# Altium project snes.PrjPcb
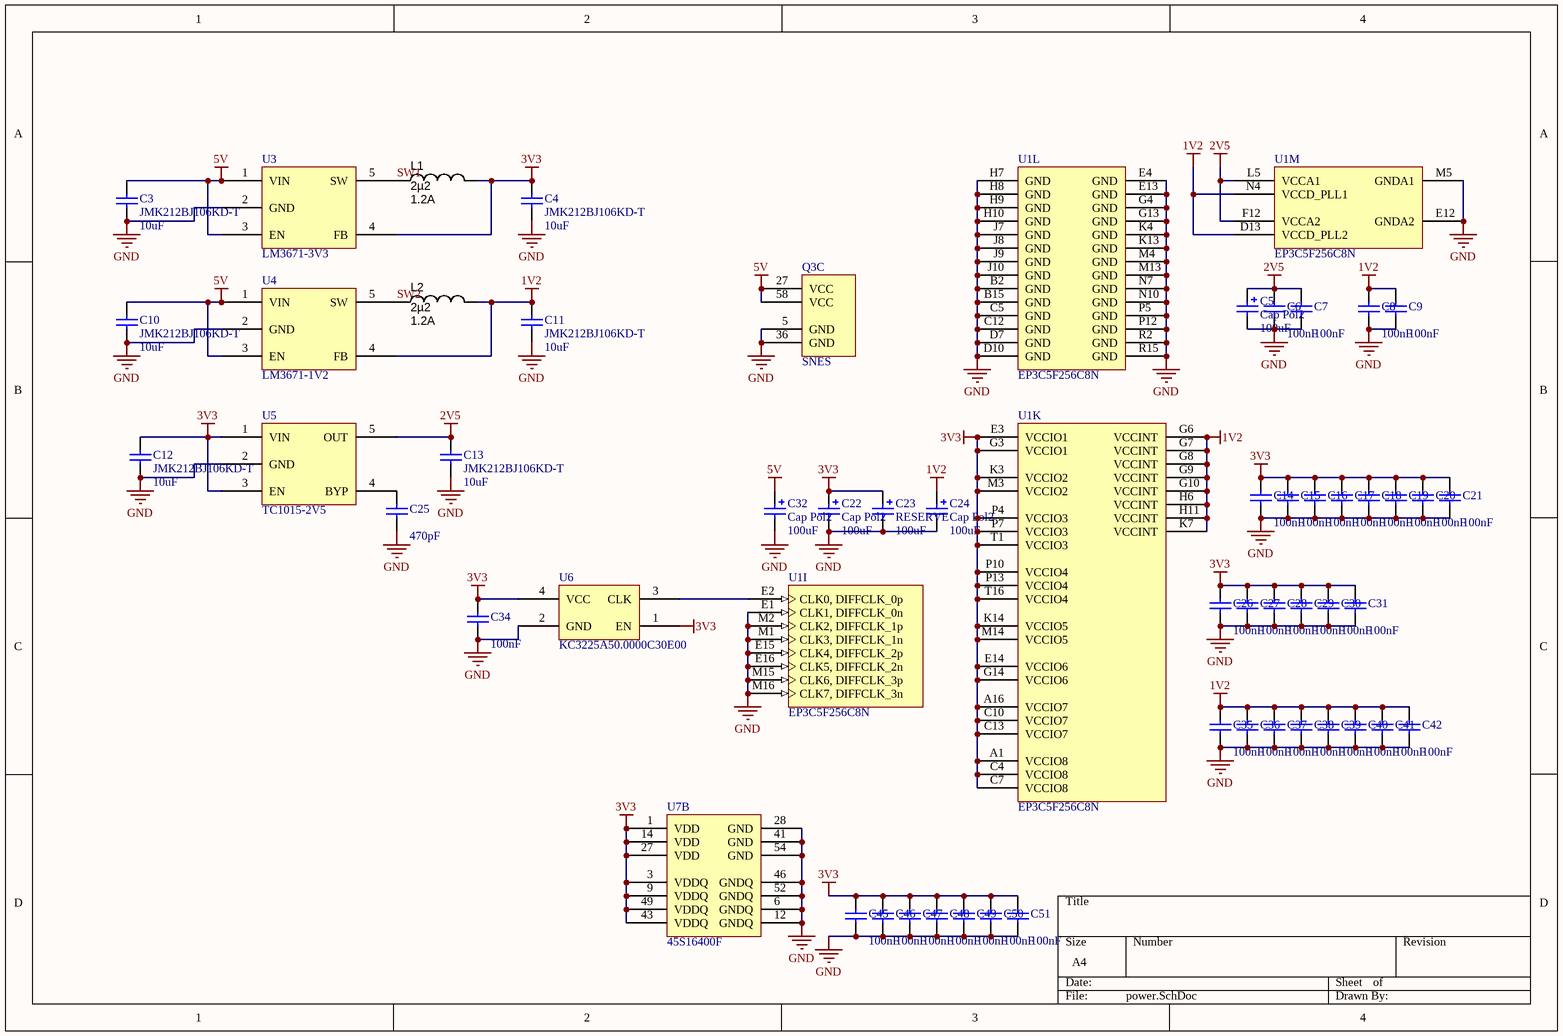
[diagram p0: power.SchDoc]
4 sheets, 87 parts. Net scope: global (net labels, ports and power ports of the same name join across sheets).
Board file: pcb.PcbDoc
Sheets:
  power.SchDoc
  snesio.SchDoc
  mem.SchDoc
  conf.SchDoc

## Sheet power.SchDoc
size A4

### Parts
C3  JMK212BJ106KD-T  value 10uF  [CAPC2012X135N]
C4  JMK212BJ106KD-T  value 10uF  [CAPC2012X135N]
C5  Cap Pol2  value 100uF  [CAPC3225X220N]
C6  value 100nF  [CAPC1005X06L]
C7  value 100nF  [CAPC1005X06L]
C8  value 100nF  [CAPC1005X06L]
C9  value 100nF  [CAPC1005X06L]
C10  JMK212BJ106KD-T  value 10uF  [CAPC2012X135N]
C11  JMK212BJ106KD-T  value 10uF  [CAPC2012X135N]
C12  JMK212BJ106KD-T  value 10uF  [CAPC2012X135N]
C13  JMK212BJ106KD-T  value 10uF  [CAPC2012X135N]
C14  value 100nF  [CAPC1005X06L]
C15  value 100nF  [CAPC1005X06L]
C16  value 100nF  [CAPC1005X06L]
C17  value 100nF  [CAPC1005X06L]
C18  value 100nF  [CAPC1005X06L]
C19  value 100nF  [CAPC1005X06L]
C20  value 100nF  [CAPC1005X06L]
C21  value 100nF  [CAPC1005X06L]
C22  Cap Pol2  value 100uF  [CAPC3225X220N]
C23  RESERVE  value 100uF  [CAPC3225X220N]
C24  Cap Pol2  value 100uF  [CAPC3225X220N]
C25  value 470pF  [CAPC2012X135N]
C26  value 100nF  [CAPC1005X06L]
C27  value 100nF  [CAPC1005X06L]
C28  value 100nF  [CAPC1005X06L]
C29  value 100nF  [CAPC1005X06L]
C30  value 100nF  [CAPC1005X06L]
C31  value 100nF  [CAPC1005X06L]
C32  Cap Pol2  value 100uF  [CAPC3225X220N]
C34  value 100nF  [CAPC1005X06L]
C35  value 100nF  [CAPC1005X06L]
C36  value 100nF  [CAPC1005X06L]
C37  value 100nF  [CAPC1005X06L]
C38  value 100nF  [CAPC1005X06L]
C39  value 100nF  [CAPC1005X06L]
C40  value 100nF  [CAPC1005X06L]
C41  value 100nF  [CAPC1005X06L]
C42  value 100nF  [CAPC1005X06L]
C45  value 100nF  [CAPC1005X06L]
C46  value 100nF  [CAPC1005X06L]
C47  value 100nF  [CAPC1005X06L]
C48  value 100nF  [CAPC1005X06L]
C49  value 100nF  [CAPC1005X06L]
C50  value 100nF  [CAPC1005X06L]
C51  value 100nF  [CAPC1005X06L]
L1  1.2A  value 2µ2  [INDM3225X240N]
L2  1.2A  value 2µ2  [INDM3225X240N]
Q3  SNES  [SNES]  (part C of 3)
U1  EP3C5F256C8N  [FBGA256-2]  (parts I,K,L,M of 13)
U3  LM3671-3V3  [SOT23-5]
U4  LM3671-1V2  [SOT23-5]
U5  TC1015-2V5  [SOT23-5]
U6  KC3225A50.0000C30E00  [KC3225A]
U7  45S16400F  [TSOP2-54_N]  (part B of 2)

### Nets
1V2: C8.2 C9.2 C11.2 C24.1 C35.2 C36.2 C37.2 C38.2 C39.2 C40.2 C41.2 C42.2 L2.2 U1.D13(VCCD_PLL2) U1.G6(VCCINT) U1.G7(VCCINT) U1.G8(VCCINT) U1.G9(VCCINT) U1.G10(VCCINT) U1.H6(VCCINT) U1.H11(VCCINT) U1.K7(VCCINT) U1.N4(VCCD_PLL1) U4.4(FB)
2V5: C5.1 C6.2 C7.2 C13.2 U1.F12(VCCA2) U1.L5(VCCA1) U5.5(OUT)
3V3: C4.2 C12.2 C14.2 C15.2 C16.2 C17.2 C18.2 C19.2 C20.2 C21.2 C22.1 C23.1 C26.2 C27.2 C28.2 C29.2 C30.2 C31.2 C34.2 C45.2 C46.2 C47.2 C48.2 C49.2 C50.2 C51.2 L1.2 U1.A1(VCCIO8) U1.A16(VCCIO7) U1.C4(VCCIO8) U1.C7(VCCIO8) U1.C10(VCCIO7) U1.C13(VCCIO7) U1.E3(VCCIO1) U1.E14(VCCIO6) U1.G3(VCCIO1) U1.G14(VCCIO6) U1.K3(VCCIO2) U1.K14(VCCIO5) U1.M3(VCCIO2) U1.M14(VCCIO5) U1.P4(VCCIO3) U1.P7(VCCIO3) U1.P10(VCCIO4) U1.P13(VCCIO4) U1.T1(VCCIO3) U1.T16(VCCIO4) U3.4(FB) U5.1(VIN) U5.3(EN) U6.1(EN) U6.4(VCC) U7.1(VDD) U7.3(VDDQ) U7.9(VDDQ) U7.14(VDD) U7.27(VDD) U7.43(VDDQ) U7.49(VDDQ)
5V: C3.2 C10.2 C32.1 Q3.27(VCC) Q3.58(VCC) U3.1(VIN) U3.3(EN) U4.1(VIN) U4.3(EN)
GND: C3.1 C4.1 C5.2 C6.1 C7.1 C8.1 C9.1 C10.1 C11.1 C12.1 C13.1 C14.1 C15.1 C16.1 C17.1 C18.1 C19.1 C20.1 C21.1 C22.2 C23.2 C24.2 C25.1 C26.1 C27.1 C28.1 C29.1 C30.1 C31.1 C32.2 C34.1 C35.1 C36.1 C37.1 C38.1 C39.1 C40.1 C41.1 C42.1 C45.1 C46.1 C47.1 C48.1 C49.1 C50.1 C51.1 Q3.5(GND) Q3.36(GND) U1.B2(GND) U1.B15(GND) U1.C5(GND) U1.C12(GND) U1.D7(GND) U1.D10(GND) U1.E1(CLK1,_DIFFCLK_0n) U1.E4(GND) U1.E12(GNDA2) U1.E13(GND) U1.E15(CLK4,_DIFFCLK_2p) U1.E16(CLK5,_DIFFCLK_2n) U1.G4(GND) U1.G13(GND) U1.H7(GND) U1.H8(GND) U1.H9(GND) U1.H10(GND) U1.J7(GND) U1.J8(GND) U1.J9(GND) U1.J10(GND) U1.K4(GND) U1.K13(GND) U1.M1(CLK3,_DIFFCLK_1n) U1.M2(CLK2,_DIFFCLK_1p) U1.M4(GND) U1.M5(GNDA1) U1.M13(GND) U1.M15(CLK6,_DIFFCLK_3p) U1.M16(CLK7,_DIFFCLK_3n) U1.N7(GND) U1.N10(GND) U1.P5(GND) U1.P12(GND) U1.R2(GND) U1.R15(GND) U3.2(GND) U4.2(GND) U5.2(GND) U6.2(GND) U7.6(GNDQ) U7.12(GNDQ) U7.28(GND) U7.41(GND) U7.46(GNDQ) U7.52(GNDQ) U7.54(GND)
SW1: L1.1 U3.5(SW)
SW2: L2.1 U4.5(SW)
NetC25_2: C25.2 U5.4(BYP)
NetU1_E2: U1.E2(CLK0,_DIFFCLK_0p) U6.3(CLK)

### Library data of the parts
C3 C4 C6-C21 C25-C31 C34-C42 C45-C51 = Cap: Capacitor; Published: 8-Jun-2000; LatestRevisionDate: 17-Jul-2002; LatestRevisionNote: Re-released for DXP Platform.; PackageReference: RAD-0.3; Publisher: Altium Limited; PackageDescription: Radial Cap, Thru-Hole; 2 Leads; 0.3 in Pin Spacing
C5 C22-C24 C32 = Cap Pol2: Polarized Capacitor (Axial); Published: 8-Jun-2000; LatestRevisionDate: 17-Jul-2002; LatestRevisionNote: Re-released for DXP Platform.; PackageReference: POLAR0.8; Publisher: Altium Limited; PackageDescription: Polarized Capacitor; 2 Leads
L1 L2 = INDC_2u2_1210_1200mA: Inductor 2.2uH 1.2A 1210 SMD chip; Manufacturer 1: TDK Corporation; Manufacturer Part Number 1: NLCV32T-2R2M-PFR; Ratings: 1.2 Adc; Tolerance: ±20%; Type: Ferrite Core; DC Resistance (DCR): 115 mOhm; Q @ Freq: 15 @ 7.96MHz; Frequency - Self Resonant: 68MHz; Frequency - Test: 7.96MHz; SCDType: source; Package / Case: 1210 (3225 Metric); Supplier 1: Digi-Key; Supplier Part Number 1: 445-3650-1-ND; ComponentLink1URL: http://www.tdk.co.jp/tefe02/e511_nlcv_nlc.pdf; ComponentLink1Description: http://www.tdk.co.jp/tefe02/e511_nlcv_nlc.pdf; Operating Temperature: -40°C ~ 125°C
U1 = EP3C5F256C8N: Cyclone III Family FPGA, 182 I/O Pins, 4 PLLs, 256-Pin FBGA, Speed Grade 8, Commercial Grade, Pb-Free; Published: 14-Mar-2008; DatasheetVersion: ver2.0, May-2008; PackageVersion: ver16.0, Dec-2009; PackageReference: FBGA256-2; Publisher: Altium Limited; PackageDescription: 256-Ball FineLine Ball Grid Array (FBGA256) - Option 2 - Wire Bond; Supplier 1: Digi-Key; Supplier Part Number 1: 544-2423-ND; Supplier 2: Farnell; Supplier Part Number 2: 1549367; Supplier 3: Farnell; Supplier Part Number 3: 1662274; Code_JEDEC: MO-192-DAF-1; ComponentLink1Description: Manufacturer Link; ComponentLink1URL: http://www.altera.com/; ComponentLink2Description: Handbook (7.86MB); ComponentLink2URL: http://www.altera.com/literature/hb/cyc3/cyclone3_handbook.pdf; ComponentLink3Description: Packaging Specification; ComponentLink3URL: http://www.altera.com/literature/ds/dspkg.pdf
U3 U4 = LM3671
U5 = TC1015
U6 = osc

## Sheet snesio.SchDoc
size A4
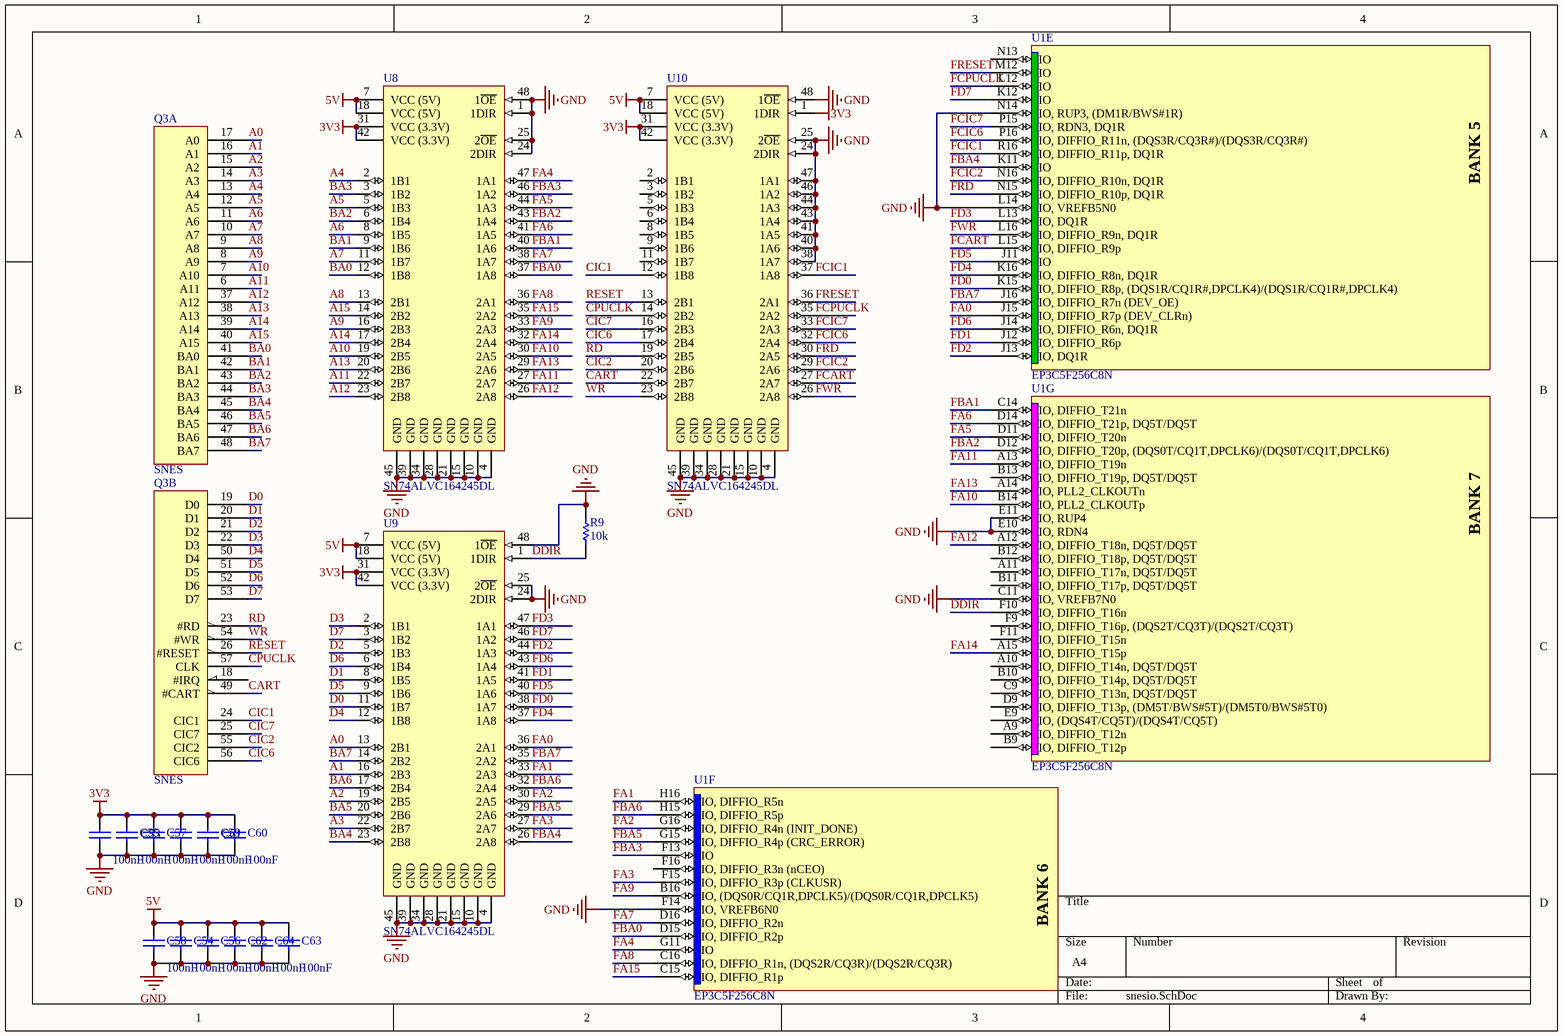
[diagram p1: snesio.SchDoc]

### Parts
C53  value 100nF  [CAPC1005X06L]
C54  value 100nF  [CAPC1005X06L]
C55  value 100nF  [CAPC1005X06L]
C56  value 100nF  [CAPC1005X06L]
C57  value 100nF  [CAPC1005X06L]
C58  value 100nF  [CAPC1005X06L]
C59  value 100nF  [CAPC1005X06L]
C60  value 100nF  [CAPC1005X06L]
C61  value 100nF  [CAPC1005X06L]
C62  value 100nF  [CAPC1005X06L]
C63  value 100nF  [CAPC1005X06L]
C64  value 100nF  [CAPC1005X06L]
Q3  SNES  [SNES]  (parts A,B of 3)
R9  value 10k  [RESC2012X70N]  (hidden comment: Res1)
U1  EP3C5F256C8N  [FBGA256-2]  (parts E,F,G of 13)
U8  SN74ALVC164245DL  [DL048]
U9  SN74ALVC164245DL  [DL048]
U10  SN74ALVC164245DL  [DL048]

### Nets
3V3: C53.2 C55.2 C57.2 C59.2 C60.2 C61.2 U8.31(VCC_(3.3V)) U8.42(VCC_(3.3V)) U9.31(VCC_(3.3V)) U9.42(VCC_(3.3V)) U10.1(1DIR) U10.31(VCC_(3.3V)) U10.42(VCC_(3.3V))
5V: C54.2 C56.2 C58.2 C62.2 C63.2 C64.2 U8.7(VCC_(5V)) U8.18(VCC_(5V)) U9.7(VCC_(5V)) U9.18(VCC_(5V)) U10.7(VCC_(5V)) U10.18(VCC_(5V))
GND: C53.1 C54.1 C55.1 C56.1 C57.1 C58.1 C59.1 C60.1 C61.1 C62.1 C63.1 C64.1 R9.1 U1.C11(IO,_VREFB7N0) U1.E10(IO,_RDN4) U1.E11(IO,_RUP4) U1.F14(IO,_VREFB6N0) U1.L14(IO,_VREFB5N0) U1.N14(IO,_RUP3,_(DM1R/BWS#1R)) U8.1(1DIR) U8.4(GND) U8.10(GND) U8.15(GND) U8.21(GND) U8.24(2DIR) U8.25(2~{OE}) U8.28(GND) U8.34(GND) U8.39(GND) U8.45(GND) U8.48(1~{OE}) U9.4(GND) U9.10(GND) U9.15(GND) U9.21(GND) U9.24(2DIR) U9.25(2~{OE}) U9.28(GND) U9.34(GND) U9.39(GND) U9.45(GND) U9.48(1~{OE}) U10.4(GND) U10.10(GND) U10.15(GND) U10.21(GND) U10.24(2DIR) U10.25(2~{OE}) U10.28(GND) U10.34(GND) U10.38(1A7) U10.39(GND) U10.40(1A6) U10.41(1A5) U10.43(1A4) U10.44(1A3) U10.45(GND) U10.46(1A2) U10.47(1A1) U10.48(1~{OE})
A0: Q3.17(A0) U9.13(2B1)
A1: Q3.16(A1) U9.16(2B3)
A2: Q3.15(A2) U9.19(2B5)
A3: Q3.14(A3) U9.22(2B7)
A4: Q3.13(A4) U8.2(1B1)
A5: Q3.12(A5) U8.5(1B3)
A6: Q3.11(A6) U8.8(1B5)
A7: Q3.10(A7) U8.11(1B7)
A8: Q3.9(A8) U8.13(2B1)
A9: Q3.8(A9) U8.16(2B3)
A10: Q3.7(A10) U8.19(2B5)
A11: Q3.6(A11) U8.22(2B7)
A12: Q3.37(A12) U8.23(2B8)
A13: Q3.38(A13) U8.20(2B6)
A14: Q3.39(A14) U8.17(2B4)
A15: Q3.40(A15) U8.14(2B2)
BA0: Q3.41(BA0) U8.12(1B8)
BA1: Q3.42(BA1) U8.9(1B6)
BA2: Q3.43(BA2) U8.6(1B4)
BA3: Q3.44(BA3) U8.3(1B2)
BA4: Q3.45(BA4) U9.23(2B8)
BA5: Q3.46(BA5) U9.20(2B6)
BA6: Q3.47(BA6) U9.17(2B4)
BA7: Q3.48(BA7) U9.14(2B2)
CART: Q3.49(#CART) U10.22(2B7)
CIC1: Q3.24(CIC1) U10.12(1B8)
CIC2: Q3.55(CIC2) U10.20(2B6)
CIC6: Q3.56(CIC6) U10.17(2B4)
CIC7: Q3.25(CIC7) U10.16(2B3)
CPUCLK: Q3.57(CLK) U10.14(2B2)
D0: Q3.19(D0) U9.11(1B7)
D1: Q3.20(D1) U9.8(1B5)
D2: Q3.21(D2) U9.5(1B3)
D3: Q3.22(D3) U9.2(1B1)
D4: Q3.50(D4) U9.12(1B8)
D5: Q3.51(D5) U9.9(1B6)
D6: Q3.52(D6) U9.6(1B4)
D7: Q3.53(D7) U9.3(1B2)
DDIR: R9.2 U1.F10(IO,_DIFFIO_T16n) U9.1(1DIR)
FA0: U1.J15(IO,_DIFFIO_R7p_(DEV_CLRn)) U9.36(2A1)
FA1: U1.H16(IO,_DIFFIO_R5n) U9.33(2A3)
FA2: U1.G16(IO,_DIFFIO_R4n_(INIT_DONE)) U9.30(2A5)
FA3: U1.F15(IO,_DIFFIO_R3p_(CLKUSR)) U9.27(2A7)
FA4: U1.G11(IO) U8.47(1A1)
FA5: U1.D11(IO,_DIFFIO_T20n) U8.44(1A3)
FA6: U1.D14(IO,_DIFFIO_T21p,_DQ5T/DQ5T) U8.41(1A5)
FA7: U1.D16(IO,_DIFFIO_R2n) U8.38(1A7)
FA8: U1.C16(IO,_DIFFIO_R1n,_(DQS2R/CQ3R)/(DQS2R/CQ3R)) U8.36(2A1)
FA9: U1.B16(IO,_(DQS0R/CQ1R,DPCLK5)/(DQS0R/CQ1R,DPCLK5)) U8.33(2A3)
FA10: U1.B14(IO,_PLL2_CLKOUTp) U8.30(2A5)
FA11: U1.A13(IO,_DIFFIO_T19n) U8.27(2A7)
FA12: U1.A12(IO,_DIFFIO_T18n,_DQ5T/DQ5T) U8.26(2A8)
FA13: U1.A14(IO,_PLL2_CLKOUTn) U8.29(2A6)
FA14: U1.A15(IO,_DIFFIO_T15p) U8.32(2A4)
FA15: U1.C15(IO,_DIFFIO_R1p) U8.35(2A2)
FBA0: U1.D15(IO,_DIFFIO_R2p) U8.37(1A8)
FBA1: U1.C14(IO,_DIFFIO_T21n) U8.40(1A6)
FBA2: U1.D12(IO,_DIFFIO_T20p,_(DQS0T/CQ1T,DPCLK6)/(DQS0T/CQ1T,DPCLK6)) U8.43(1A4)
FBA3: U1.F13(IO) U8.46(1A2)
FBA4: U1.K11(IO) U9.26(2A8)
FBA5: U1.G15(IO,_DIFFIO_R4p_(CRC_ERROR)) U9.29(2A6)
FBA6: U1.H15(IO,_DIFFIO_R5p) U9.32(2A4)
FBA7: U1.J16(IO,_DIFFIO_R7n_(DEV_OE)) U9.35(2A2)
FCART: U1.L15(IO,_DIFFIO_R9p) U10.27(2A7)
FCIC1: U1.R16(IO,_DIFFIO_R11p,_DQ1R) U10.37(1A8)
FCIC2: U1.N16(IO,_DIFFIO_R10n,_DQ1R) U10.29(2A6)
FCIC6: U1.P16(IO,_DIFFIO_R11n,_(DQS3R/CQ3R#)/(DQS3R/CQ3R#)) U10.32(2A4)
FCIC7: U1.P15(IO,_RDN3,_DQ1R) U10.33(2A3)
FCPUCLK: U1.L12(IO) U10.35(2A2)
FD0: U1.K15(IO,_DIFFIO_R8p,_(DQS1R/CQ1R#,DPCLK4)/(DQS1R/CQ1R#,DPCLK4)) U9.38(1A7)
FD1: U1.J12(IO,_DIFFIO_R6p) U9.41(1A5)
FD2: U1.J13(IO,_DQ1R) U9.44(1A3)
FD3: U1.L13(IO,_DQ1R) U9.47(1A1)
FD4: U1.K16(IO,_DIFFIO_R8n,_DQ1R) U9.37(1A8)
FD5: U1.J11(IO) U9.40(1A6)
FD6: U1.J14(IO,_DIFFIO_R6n,_DQ1R) U9.43(1A4)
FD7: U1.K12(IO) U9.46(1A2)
FRD: U1.N15(IO,_DIFFIO_R10p,_DQ1R) U10.30(2A5)
FRESET: U1.M12(IO) U10.36(2A1)
FWR: U1.L16(IO,_DIFFIO_R9n,_DQ1R) U10.26(2A8)
RD: Q3.23(#RD) U10.19(2B5)
RESET: Q3.26(#RESET) U10.13(2B1)
WR: Q3.54(#WR) U10.23(2B8)

Not connected (* = marked no-connect by the designer): Q3 18(#IRQ); U1 A9(IO,_DIFFIO_T12n) A10(IO,_DIFFIO_T14n,_DQ5T/DQ5T) A11(IO,_DIFFIO_T17n,_DQ5T/DQ5T) B9(IO,_DIFFIO_T12p) B10(IO,_DIFFIO_T14p,_DQ5T/DQ5T) B11(IO,_DIFFIO_T17p,_DQ5T/DQ5T) B12(IO,_DIFFIO_T18p,_DQ5T/DQ5T) B13(IO,_DIFFIO_T19p,_DQ5T/DQ5T) C9(IO,_DIFFIO_T13n,_DQ5T/DQ5T) D9(IO,_DIFFIO_T13p,_(DM5T/BWS#5T)/(DM5T0/BWS#5T0)) E9(IO,_(DQS4T/CQ5T)/(DQS4T/CQ5T)) F9(IO,_DIFFIO_T16p,_(DQS2T/CQ3T)/(DQS2T/CQ3T)) F11(IO,_DIFFIO_T15n) F16(IO,_DIFFIO_R3n_(nCEO)) N13(IO); U10 2(1B1) 3(1B2) 5(1B3) 6(1B4) 8(1B5) 9(1B6) 11(1B7)

### Notes on the sheet
- (in symbol EP3C5F256C8N, part E) BANK 5
- (in symbol EP3C5F256C8N, part F) BANK 6
- (in symbol EP3C5F256C8N, part G) BANK 7

### Library data of the parts
C53-C64 = Cap: Capacitor; Published: 8-Jun-2000; LatestRevisionDate: 17-Jul-2002; LatestRevisionNote: Re-released for DXP Platform.; PackageReference: RAD-0.3; Publisher: Altium Limited; PackageDescription: Radial Cap, Thru-Hole; 2 Leads; 0.3 in Pin Spacing
R9 = Res1: Resistor; Published: 8-Jun-2000; LatestRevisionDate: 17-Jul-2002; LatestRevisionNote: Re-released for DXP Platform.; PackageReference: AXIAL-0.3; Publisher: Altium Limited; PackageDescription: Axial Device, Thru-Hole; 2 Leads; 0.3 in Pin Spacing
U1 = EP3C5F256C8N: as U1 on sheet power; Published: 14-Mar-2008; DatasheetVersion: ver2.0, May-2008; PackageVersion: ver16.0, Dec-2009; PackageReference: FBGA256-2; Publisher: Altium Limited; PackageDescription: 256-Ball FineLine Ball Grid Array (FBGA256) - Option 2 - Wire Bond; Supplier 1: Digi-Key; Supplier Part Number 1: 544-2423-ND; Supplier 2: Farnell; Supplier Part Number 2: 1549367; Supplier 3: Farnell; Supplier Part Number 3: 1662274; Code_JEDEC: MO-192-DAF-1; ComponentLink1Description: Manufacturer Link; ComponentLink1URL: http://www.altera.com/; ComponentLink2Description: Handbook (7.86MB); ComponentLink2URL: http://www.altera.com/literature/hb/cyc3/cyclone3_handbook.pdf; ComponentLink3Description: Packaging Specification; ComponentLink3URL: http://www.altera.com/literature/ds/dspkg.pdf
U8-U10 = SN74ALVC164245DL: 16-Bit 3.3-V to 5-V Level Shifting Transceiver with 3-State Outputs; Published: 8-Jun-2000; LatestRevisionDate: 04-Mar-2005; LatestRevisionNote: Stylized 3D Model Added.; DatasheetVersion: Feb-1999; PackageVersion: Dec-2001; PackageReference: DL048; Publisher: Altium Limited; PackageDescription: SSOP; 48 Leads; Body Width 7.5 mm; Pitch 0.635 mm; Code_JEDEC: MO-118-AA; Code_IPC: SSO48; ComponentLink1Description: Manufacturer Link; ComponentLink1URL: http://www.ti.com/; ComponentLink2Description: Datasheet; ComponentLink2URL: http://www-s.ti.com/sc/ds/sn74alvc164245.pdf

## Sheet mem.SchDoc
size A4
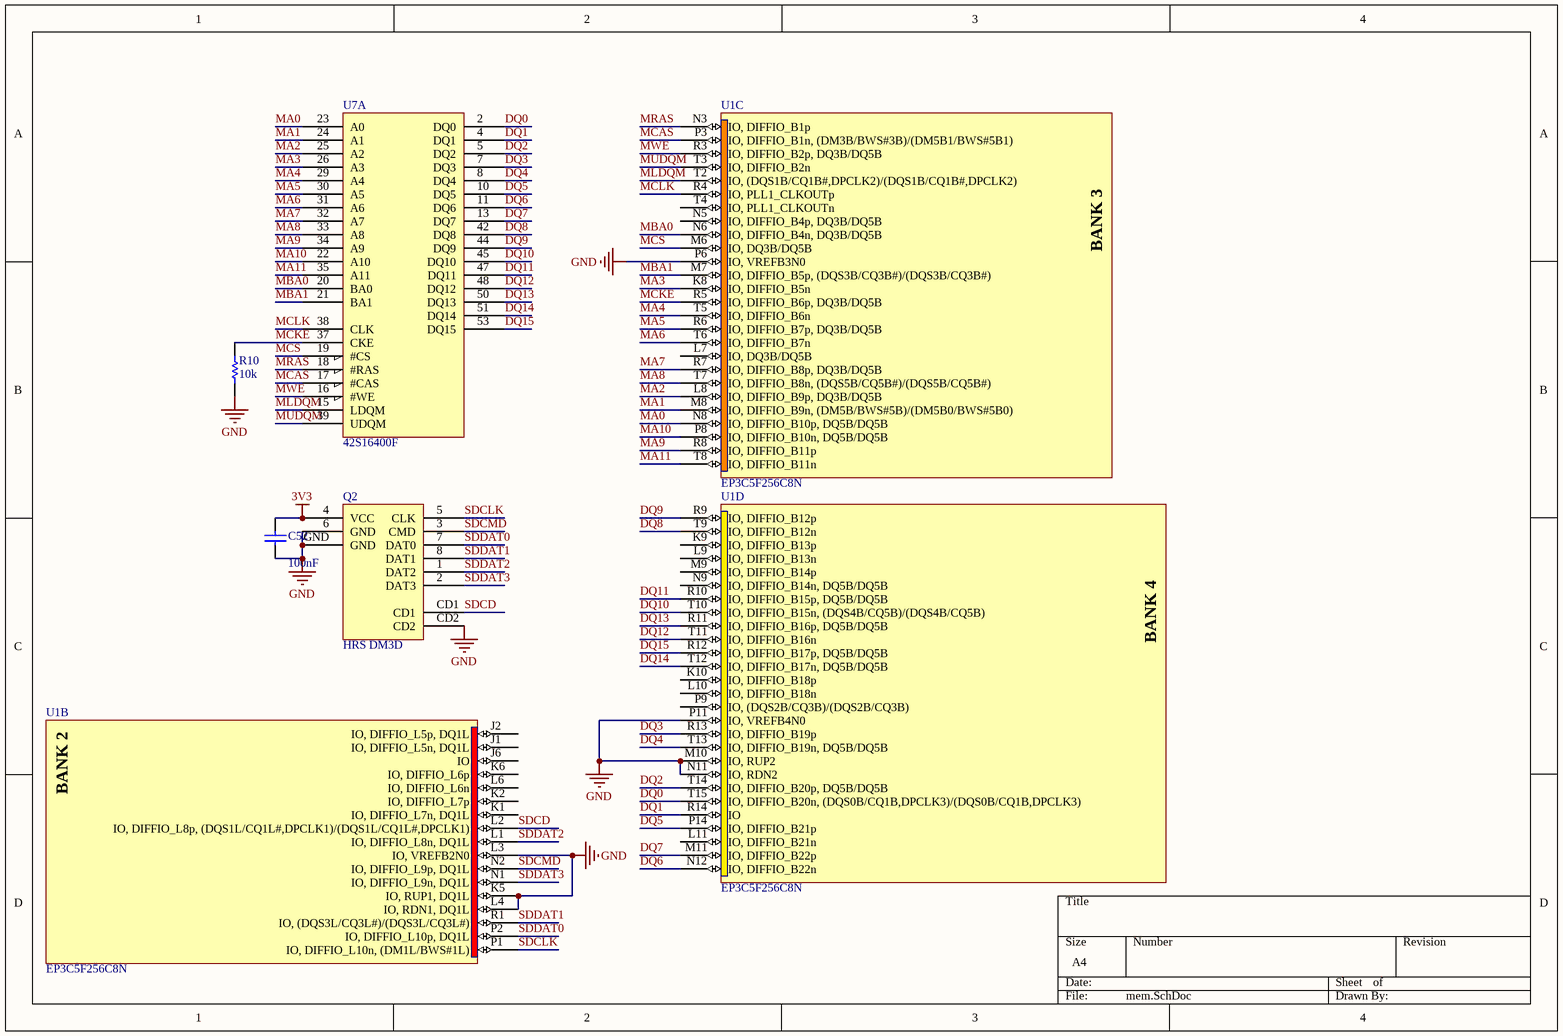
[diagram p2: mem.SchDoc]

### Parts
C52  value 100nF  [CAPC1005X06L]
Q2  HRS DM3D  [HRS DM3D]
R10  value 10k  [CAPC2012X135N]  (hidden comment: Res1)
U1  EP3C5F256C8N  [FBGA256-2]  (parts B,C,D of 13)
U7  42S16400F  [54_TSOP2_400AF_N]  (part A of 2)

### Nets
3V3: C52.2 Q2.4(VCC)
GND: C52.1 Q2.6(GND) Q2.CD2 Q2.GND R10.1 U1.K5(IO,_RUP1,_DQ1L) U1.L3(IO,_VREFB2N0) U1.L4(IO,_RDN1,_DQ1L) U1.M10(IO,_RUP2) U1.N11(IO,_RDN2) U1.P6(IO,_VREFB3N0) U1.P11(IO,_VREFB4N0)
DQ0: U1.T15(IO,_DIFFIO_B20n,_(DQS0B/CQ1B,DPCLK3)/(DQS0B/CQ1B,DPCLK3)) U7.2(DQ0)
DQ1: U1.R14(IO) U7.4(DQ1)
DQ2: U1.T14(IO,_DIFFIO_B20p,_DQ5B/DQ5B) U7.5(DQ2)
DQ3: U1.R13(IO,_DIFFIO_B19p) U7.7(DQ3)
DQ4: U1.T13(IO,_DIFFIO_B19n,_DQ5B/DQ5B) U7.8(DQ4)
DQ5: U1.P14(IO,_DIFFIO_B21p) U7.10(DQ5)
DQ6: U1.N12(IO,_DIFFIO_B22n) U7.11(DQ6)
DQ7: U1.M11(IO,_DIFFIO_B22p) U7.13(DQ7)
DQ8: U1.T9(IO,_DIFFIO_B12n) U7.42(DQ8)
DQ9: U1.R9(IO,_DIFFIO_B12p) U7.44(DQ9)
DQ10: U1.T10(IO,_DIFFIO_B15n,_(DQS4B/CQ5B)/(DQS4B/CQ5B)) U7.45(DQ10)
DQ11: U1.R10(IO,_DIFFIO_B15p,_DQ5B/DQ5B) U7.47(DQ11)
DQ12: U1.T11(IO,_DIFFIO_B16n) U7.48(DQ12)
DQ13: U1.R11(IO,_DIFFIO_B16p,_DQ5B/DQ5B) U7.50(DQ13)
DQ14: U1.T12(IO,_DIFFIO_B17n,_DQ5B/DQ5B) U7.51(DQ14)
DQ15: U1.R12(IO,_DIFFIO_B17p,_DQ5B/DQ5B) U7.53(DQ15)
MA0: U1.N8(IO,_DIFFIO_B10p,_DQ5B/DQ5B) U7.23(A0)
MA1: U1.M8(IO,_DIFFIO_B9n,_(DM5B/BWS#5B)/(DM5B0/BWS#5B0)) U7.24(A1)
MA2: U1.L8(IO,_DIFFIO_B9p,_DQ3B/DQ5B) U7.25(A2)
MA3: U1.K8(IO,_DIFFIO_B5n) U7.26(A3)
MA4: U1.T5(IO,_DIFFIO_B6n) U7.29(A4)
MA5: U1.R6(IO,_DIFFIO_B7p,_DQ3B/DQ5B) U7.30(A5)
MA6: U1.T6(IO,_DIFFIO_B7n) U7.31(A6)
MA7: U1.R7(IO,_DIFFIO_B8p,_DQ3B/DQ5B) U7.32(A7)
MA8: U1.T7(IO,_DIFFIO_B8n,_(DQS5B/CQ5B#)/(DQS5B/CQ5B#)) U7.33(A8)
MA9: U1.R8(IO,_DIFFIO_B11p) U7.34(A9)
MA10: U1.P8(IO,_DIFFIO_B10n,_DQ5B/DQ5B) U7.22(A10)
MA11: U1.T8(IO,_DIFFIO_B11n) U7.35(A11)
MBA0: U1.N6(IO,_DIFFIO_B4n,_DQ3B/DQ5B) U7.20(BA0)
MBA1: U1.M7(IO,_DIFFIO_B5p,_(DQS3B/CQ3B#)/(DQS3B/CQ3B#)) U7.21(BA1)
MCAS: U1.P3(IO,_DIFFIO_B1n,_(DM3B/BWS#3B)/(DM5B1/BWS#5B1)) U7.17(#CAS)
MCKE: R10.2 U1.R5(IO,_DIFFIO_B6p,_DQ3B/DQ5B) U7.37(CKE)
MCLK: U1.R4(IO,_PLL1_CLKOUTp) U7.38(CLK)
MCS: U1.M6(IO,_DQ3B/DQ5B) U7.19(#CS)
MLDQM: U1.T2(IO,_(DQS1B/CQ1B#,DPCLK2)/(DQS1B/CQ1B#,DPCLK2)) U7.15(LDQM)
MRAS: U1.N3(IO,_DIFFIO_B1p) U7.18(#RAS)
MUDQM: U1.T3(IO,_DIFFIO_B2n) U7.39(UDQM)
MWE: U1.R3(IO,_DIFFIO_B2p,_DQ3B/DQ5B) U7.16(#WE)
SDCD: Q2.CD1 U1.L2(IO,_DIFFIO_L8p,_(DQS1L/CQ1L#,DPCLK1)/(DQS1L/CQ1L#,DPCLK1))
SDCLK: Q2.5(CLK) U1.P1(IO,_DIFFIO_L10n,_(DM1L/BWS#1L))
SDCMD: Q2.3(CMD) U1.N2(IO,_DIFFIO_L9p,_DQ1L)
SDDAT0: Q2.7(DAT0) U1.P2(IO,_DIFFIO_L10p,_DQ1L)
SDDAT1: Q2.8(DAT1) U1.R1(IO,_(DQS3L/CQ3L#)/(DQS3L/CQ3L#))
SDDAT2: Q2.1(DAT2) U1.L1(IO,_DIFFIO_L8n,_DQ1L)
SDDAT3: Q2.2(DAT3) U1.N1(IO,_DIFFIO_L9n,_DQ1L)

Not connected (* = marked no-connect by the designer): U1 J1(IO,_DIFFIO_L5n,_DQ1L) J2(IO,_DIFFIO_L5p,_DQ1L) J6(IO) K1(IO,_DIFFIO_L7n,_DQ1L) K2(IO,_DIFFIO_L7p) K6(IO,_DIFFIO_L6p) K9(IO,_DIFFIO_B13p) K10(IO,_DIFFIO_B18p) L6(IO,_DIFFIO_L6n) L7(IO,_DQ3B/DQ5B) L9(IO,_DIFFIO_B13n) L10(IO,_DIFFIO_B18n) L11(IO,_DIFFIO_B21n) M9(IO,_DIFFIO_B14p) N5(IO,_DIFFIO_B4p,_DQ3B/DQ5B) N9(IO,_DIFFIO_B14n,_DQ5B/DQ5B) P9(IO,_(DQS2B/CQ3B)/(DQS2B/CQ3B)) T4(IO,_PLL1_CLKOUTn)

### Notes on the sheet
- (in symbol EP3C5F256C8N, part B) BANK 2
- (in symbol EP3C5F256C8N, part C) BANK 3
- (in symbol EP3C5F256C8N, part D) BANK 4

### Library data of the parts
C52 = Cap: Capacitor; Published: 8-Jun-2000; LatestRevisionDate: 17-Jul-2002; LatestRevisionNote: Re-released for DXP Platform.; PackageReference: RAD-0.3; Publisher: Altium Limited; PackageDescription: Radial Cap, Thru-Hole; 2 Leads; 0.3 in Pin Spacing
R10 = Res1: Resistor; Published: 8-Jun-2000; LatestRevisionDate: 17-Jul-2002; LatestRevisionNote: Re-released for DXP Platform.; PackageReference: AXIAL-0.3; Publisher: Altium Limited; PackageDescription: Axial Device, Thru-Hole; 2 Leads; 0.3 in Pin Spacing
U1 = EP3C5F256C8N: as U1 on sheet power; Published: 14-Mar-2008; DatasheetVersion: ver2.0, May-2008; PackageVersion: ver16.0, Dec-2009; PackageReference: FBGA256-2; Publisher: Altium Limited; PackageDescription: 256-Ball FineLine Ball Grid Array (FBGA256) - Option 2 - Wire Bond; Supplier 1: Digi-Key; Supplier Part Number 1: 544-2423-ND; Supplier 2: Farnell; Supplier Part Number 2: 1549367; Supplier 3: Farnell; Supplier Part Number 3: 1662274; Code_JEDEC: MO-192-DAF-1; ComponentLink1Description: Manufacturer Link; ComponentLink1URL: http://www.altera.com/; ComponentLink2Description: Handbook (7.86MB); ComponentLink2URL: http://www.altera.com/literature/hb/cyc3/cyclone3_handbook.pdf; ComponentLink3Description: Packaging Specification; ComponentLink3URL: http://www.altera.com/literature/ds/dspkg.pdf
U7 = 45S16400F

## Sheet conf.SchDoc
size A4
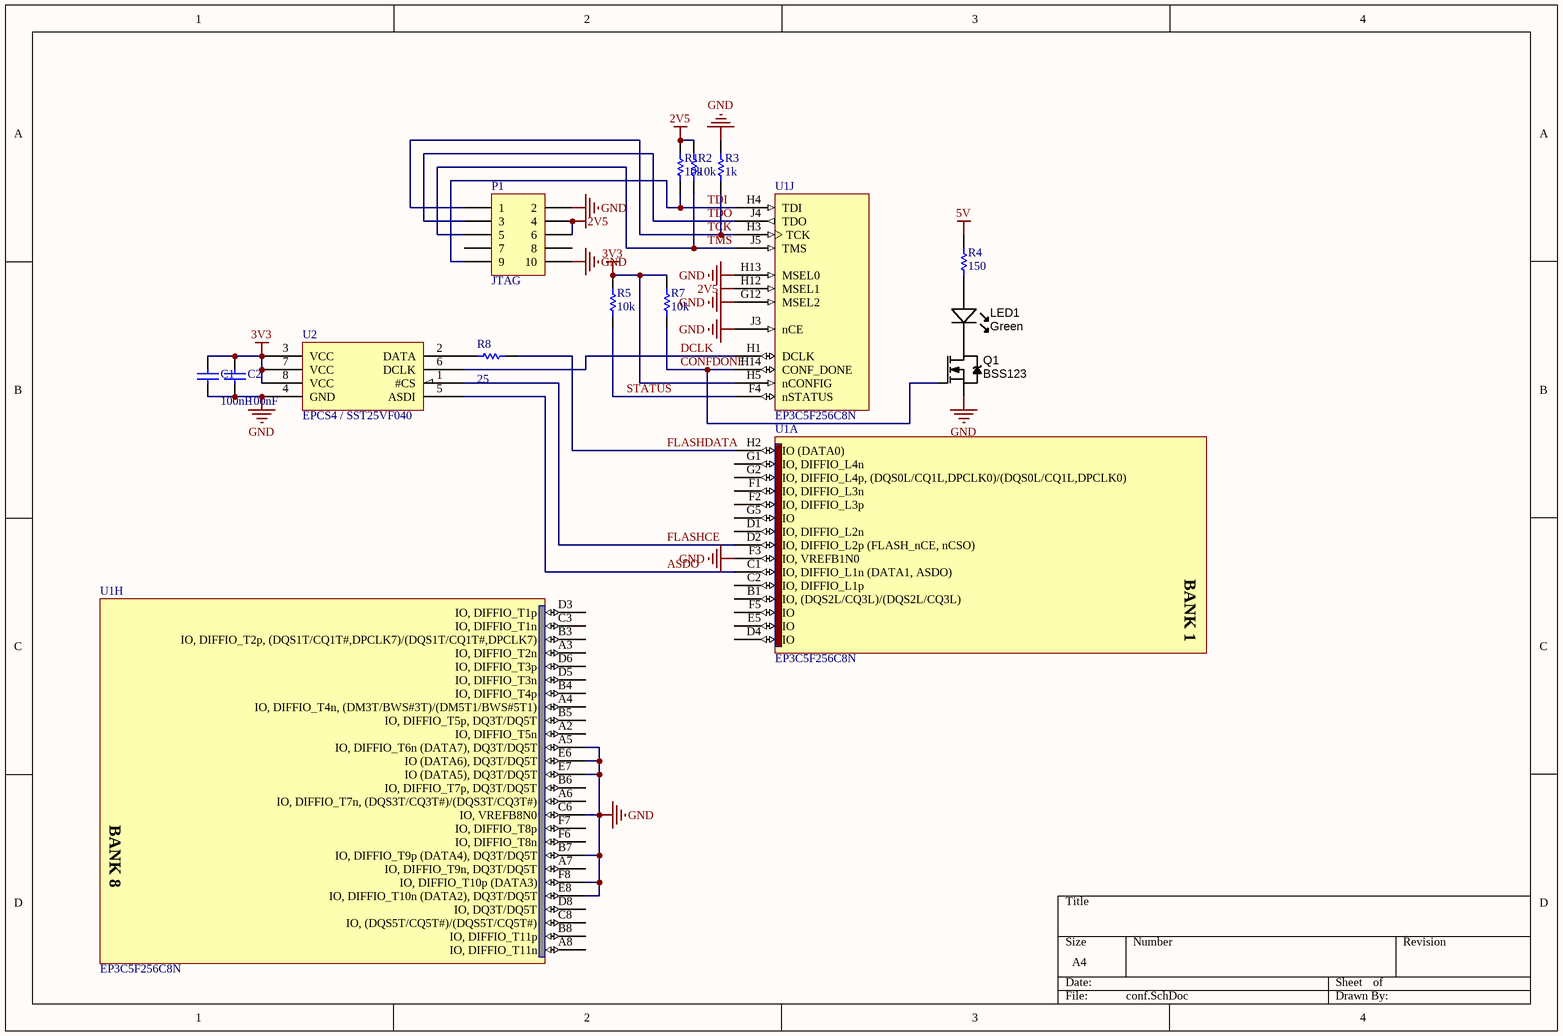
[diagram p3: conf.SchDoc]

### Parts
C1  value 100nF  [CAPC1005X06L]
C2  value 100nF  [CAPC1005X06L]
LED1  Green  [LED-0603-GREEN]
P1  JTAG  [HDR2X5]
Q1  BSS123  [SOT23-3]
R1  value 10k  [RESC2012X70N]  (hidden comment: Res1)
R2  value 10k  [RESC2012X70N]  (hidden comment: Res1)
R3  value 1k  [RESC2012X70N]  (hidden comment: Res1)
R4  value 150  [RESC2012X70N]  (hidden comment: Res1)
R5  value 10k  [RESC2012X70N]  (hidden comment: Res1)
R7  value 10k  [RESC2012X70N]  (hidden comment: Res1)
R8  value 25  [RESC2012X70N]  (hidden comment: Res1)
U1  EP3C5F256C8N  [FBGA256-2]  (parts A,H,J of 13)
U2  EPCS4 / SST25VF040  [SOIC127P600X175-8AN]

### Nets
2V5: P1.4 P1.6 R1.2 R2.2 U1.H12(MSEL1)
3V3: C1.2 C2.2 R5.2 R7.2 U1.H5(nCONFIG) U2.3(VCC) U2.7(VCC) U2.8(VCC)
5V: R4.2
GND: C1.1 C2.1 P1.2 P1.10 Q1.2(S) R3.2 U1.A5(IO,_DIFFIO_T6n_(DATA7),_DQ3T/DQ5T) U1.B7(IO,_DIFFIO_T9p_(DATA4),_DQ3T/DQ5T) U1.C6(IO,_VREFB8N0) U1.E6(IO_(DATA6),_DQ3T/DQ5T) U1.E7(IO_(DATA5),_DQ3T/DQ5T) U1.E8(IO,_DIFFIO_T10n_(DATA2),_DQ3T/DQ5T) U1.F3(IO,_VREFB1N0) U1.F8(IO,_DIFFIO_T10p_(DATA3)) U1.G12(MSEL2) U1.H13(MSEL0) U1.J3(nCE) U2.4(GND)
ASDO: U1.C1(IO,_DIFFIO_L1n_(DATA1,_ASDO)) U2.5(ASDI)
CONFDONE: Q1.1(G) R7.1 U1.H14(CONF_DONE)
DCLK: U1.H1(DCLK) U2.6(DCLK)
FLASHCE: U1.D2(IO,_DIFFIO_L2p_(FLASH_nCE,_nCSO)) U2.1(#CS)
FLASHDATA: R8.2 U1.H2(IO_(DATA0))
STATUS: R5.1 U1.F4(nSTATUS)
TCK: P1.1 R3.1 U1.H3(TCK)
TDI: P1.9 R1.1 U1.H4(TDI)
TDO: P1.3 U1.J4(TDO)
TMS: P1.5 R2.1 U1.J5(TMS)
NetLED1_A: LED1.A R4.1
NetLED1_K: LED1.K Q1.3(D)
NetR8_1: R8.1 U2.2(DATA)

Not connected (* = marked no-connect by the designer): P1 7 8; U1 A2(IO,_DIFFIO_T5n) A3(IO,_DIFFIO_T2n) A4(IO,_DIFFIO_T4n,_(DM3T/BWS#3T)/(DM5T1/BWS#5T1)) A6(IO,_DIFFIO_T7n,_(DQS3T/CQ3T#)/(DQS3T/CQ3T#)) A7(IO,_DIFFIO_T9n,_DQ3T/DQ5T) A8(IO,_DIFFIO_T11n) B1(IO,_(DQS2L/CQ3L)/(DQS2L/CQ3L)) B3(IO,_DIFFIO_T2p,_(DQS1T/CQ1T#,DPCLK7)/(DQS1T/CQ1T#,DPCLK7)) B4(IO,_DIFFIO_T4p) B5(IO,_DIFFIO_T5p,_DQ3T/DQ5T) B6(IO,_DIFFIO_T7p,_DQ3T/DQ5T) B8(IO,_DIFFIO_T11p) C2(IO,_DIFFIO_L1p) C3(IO,_DIFFIO_T1n) C8(IO,_(DQS5T/CQ5T#)/(DQS5T/CQ5T#)) D1(IO,_DIFFIO_L2n) D3(IO,_DIFFIO_T1p) D4(IO) D5(IO,_DIFFIO_T3n) D6(IO,_DIFFIO_T3p) D8(IO,_DQ3T/DQ5T) E5(IO) F1(IO,_DIFFIO_L3n) F2(IO,_DIFFIO_L3p) F5(IO) F6(IO,_DIFFIO_T8n) F7(IO,_DIFFIO_T8p) G1(IO,_DIFFIO_L4n) G2(IO,_DIFFIO_L4p,_(DQS0L/CQ1L,DPCLK0)/(DQS0L/CQ1L,DPCLK0)) G5(IO)

### Notes on the sheet
- (in symbol EP3C5F256C8N, part A) BANK 1
- (in symbol EP3C5F256C8N, part H) BANK 8

### Library data of the parts
C1 C2 = Cap: Capacitor; Published: 8-Jun-2000; LatestRevisionDate: 17-Jul-2002; LatestRevisionNote: Re-released for DXP Platform.; PackageReference: RAD-0.3; Publisher: Altium Limited; PackageDescription: Radial Cap, Thru-Hole; 2 Leads; 0.3 in Pin Spacing
LED1 = LED_SMD_Green_0603_570nm: LED 0603 SMD Green 570nm 50mcd 20mA; Manufacturer 1: Kingbright Company LLC; Manufacturer Part Number 1: APT1608CGCK; Material: AlGaInP; Ratings: 20mcd min; 50 mcd typ; 570 nm; Voltage - Forward (Vf) Typ: 2.1V; Viewing Angle: 120°; Lens Style/Size: Rectangle with Flat Top, 1.1mm x 0.8mm; Voltage - Forward (Vf) @ 10mA: 2.0V; SCDType: source; Wavelength - Peak: 574nm; Lens Type: Clear; Package / Case: 0603 (1608 metric); Color: Green; Current - Test: 20mA; Supplier 1: Digi-Key; Supplier Part Number 1: 754-1116-1-ND; RoHS 1: RoHS Compliant; Wavelength - Dominant: 570nm; ComponentLink1URL: http://www.us.kingbright.com/images/catalog/SPEC/APT1608CGCK.pdf; ComponentLink1Description: http://www.us.kingbright.com/images/catalog/SPEC/APT1608CGCK.pdf
P1 = Header 5X2: Header, 5-Pin, Dual row; LatestRevisionDate: 17-Jul-2002; LatestRevisionNote: Re-released for DXP Platform.; Publisher: Altium Limited
Q1 = MOSFET_BSS123: MOSFET SMD N-CH 100V 170mA SOT23-3; Manufacturer 1: Diodes Inc; Manufacturer Part Number 1: BSS123-7-F; Ratings: 100V; 170mA; Material: Metal Oxide; SCDType: source; Package / Case: SOT23-3; Supplier 1: Digi-Key; Supplier Part Number 1: BSS123-FDICT-ND
R1-R5 R7 R8 = Res1: Resistor; Published: 8-Jun-2000; LatestRevisionDate: 17-Jul-2002; LatestRevisionNote: Re-released for DXP Platform.; PackageReference: AXIAL-0.3; Publisher: Altium Limited; PackageDescription: Axial Device, Thru-Hole; 2 Leads; 0.3 in Pin Spacing
U1 = EP3C5F256C8N: as U1 on sheet power; Published: 14-Mar-2008; DatasheetVersion: ver2.0, May-2008; PackageVersion: ver16.0, Dec-2009; PackageReference: FBGA256-2; Publisher: Altium Limited; PackageDescription: 256-Ball FineLine Ball Grid Array (FBGA256) - Option 2 - Wire Bond; Supplier 1: Digi-Key; Supplier Part Number 1: 544-2423-ND; Supplier 2: Farnell; Supplier Part Number 2: 1549367; Supplier 3: Farnell; Supplier Part Number 3: 1662274; Code_JEDEC: MO-192-DAF-1; ComponentLink1Description: Manufacturer Link; ComponentLink1URL: http://www.altera.com/; ComponentLink2Description: Handbook (7.86MB); ComponentLink2URL: http://www.altera.com/literature/hb/cyc3/cyclone3_handbook.pdf; ComponentLink3Description: Packaging Specification; ComponentLink3URL: http://www.altera.com/literature/ds/dspkg.pdf
U2 = EPCS4

## Nets that join several sheets
2V5: power (7 pins), conf (5 pins)
3V3: power (59 pins), snesio (13 pins), mem (C52.2 Q2.4), conf (8 pins)
5V: power (9 pins), snesio (12 pins), conf (R4.2)
GND: power (96 pins), snesio (60 pins), mem (12 pins), conf (18 pins)